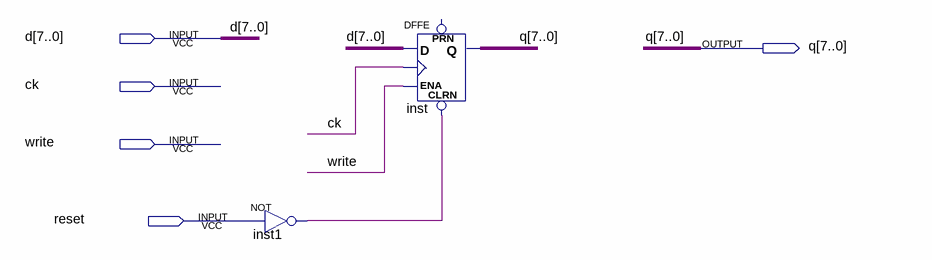
[diagram p0: schematic sheet]
// Quartus schematic palavra.bdf as structural Verilog: 2 symbols, 5 pins
module palavra (
  input  [7:0] d,
  input  ck,
  input  write,
  input  reset,
  output [7:0] q
);

  wire inst1_out;

  not inst1 (inst1_out, reset);
  DFFE inst[7:0] (.CLRN(inst1_out), .D(d), .CLK(ck), .ENA(write), .Q(q));  // open: PRN
endmodule
